# Altium schematic sheet LV-MaxSonar Connector.SchDoc: Distance echo sensor
size A4; Organization: Altium Limited; Address1: 3 Minna Close; Address2: Belrose; Address3: NSW 2085; Address4: Australia
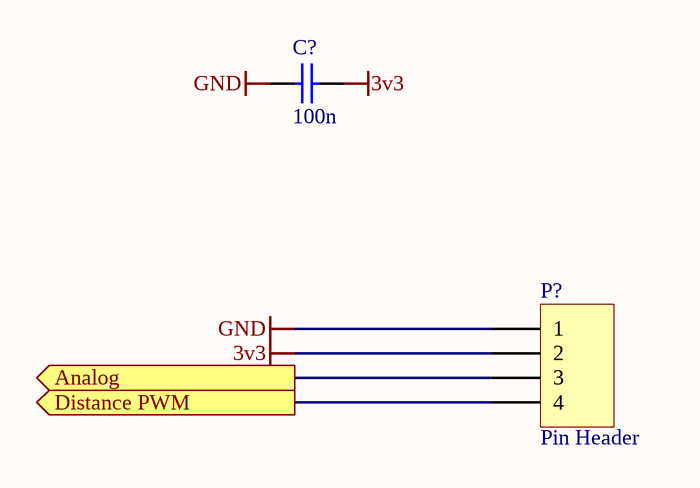
[diagram p0: LV-MaxSonar Connector.SchDoc]

## Parts
C?  100n  [C0805]
P?  Pin Header  [PH1x4_2.54]

## Ports
Analog (out), Distance PWM (out)

## Nets
3v3: C?.2 P?.2
GND: C?.1 P?.1
Analog: P?.3 ; port Analog
Distance PWM: P?.4 ; port Distance PWM

## Notes on the sheet
- Disclaimer
  Any design and information, hardware or software  is provided on an "as-is" basis without warranty of any kind and any express or implied warranties, including, but not limited to, the implied warranties of merchantability and fitness for a particular purpose are disclaimed. In no event shall wnpd (or KeaDrone)be liable for any direct, indirect, incidental, special, exemplary, or consequential damages (including, but not limited to, procurement of substitute goods or services; loss of use, data, or profits; or business interruption) however caused and on any theory of liability, whether in contract, strict liability, or tort (including negligence or otherwise) arising in any way out of the use of this firmware, hardware, software or information, even if wnpd (or KeaDrone) has been advised by user of the possibility of such potential loss or damage. The user agrees to hold wnpd (or KeaDrone) harmless from and against any and all claims, losses, liabilities and expenses.
- Title
- Size:
- Date:
- A4
- Name:
- Time:
- Ing. W. Pietersz
- Revision:
- Sheet
- of
- WillyPietersz@gmail.com
- Contact:
- -
- www.wnpd.nl
- File:

## Library data of the parts
C? = 100n: Tolerance: 0.1; LatestRevision Note: Initial Release; Part Number: 100n; Value: 100n; Package: 0805; Component Type: Standard; LatestRevision Date: 31-7-2010; Author: Willy Pietersz; Supplier 2: Farnell; Supplier Part Number 2: 1759266; ComponentLink1Description: Manufacturer; ComponentLink2Description: Datasheet
P? = PH1x4: Con1x4; Part Number: PH1x4; Pitch: 2.54; LatestRevision Note: Initial Release; Type: Pin Header; Number Of Pins: 4; Component Type: Standard; LatestRevision Date: 23-11-2010; Author: Willy Pietersz; Supplier 2: Farnell